# EAGLE design bb-psu-mk-1.1 (EAGLE 6.5.0)
VERSION: 1.0
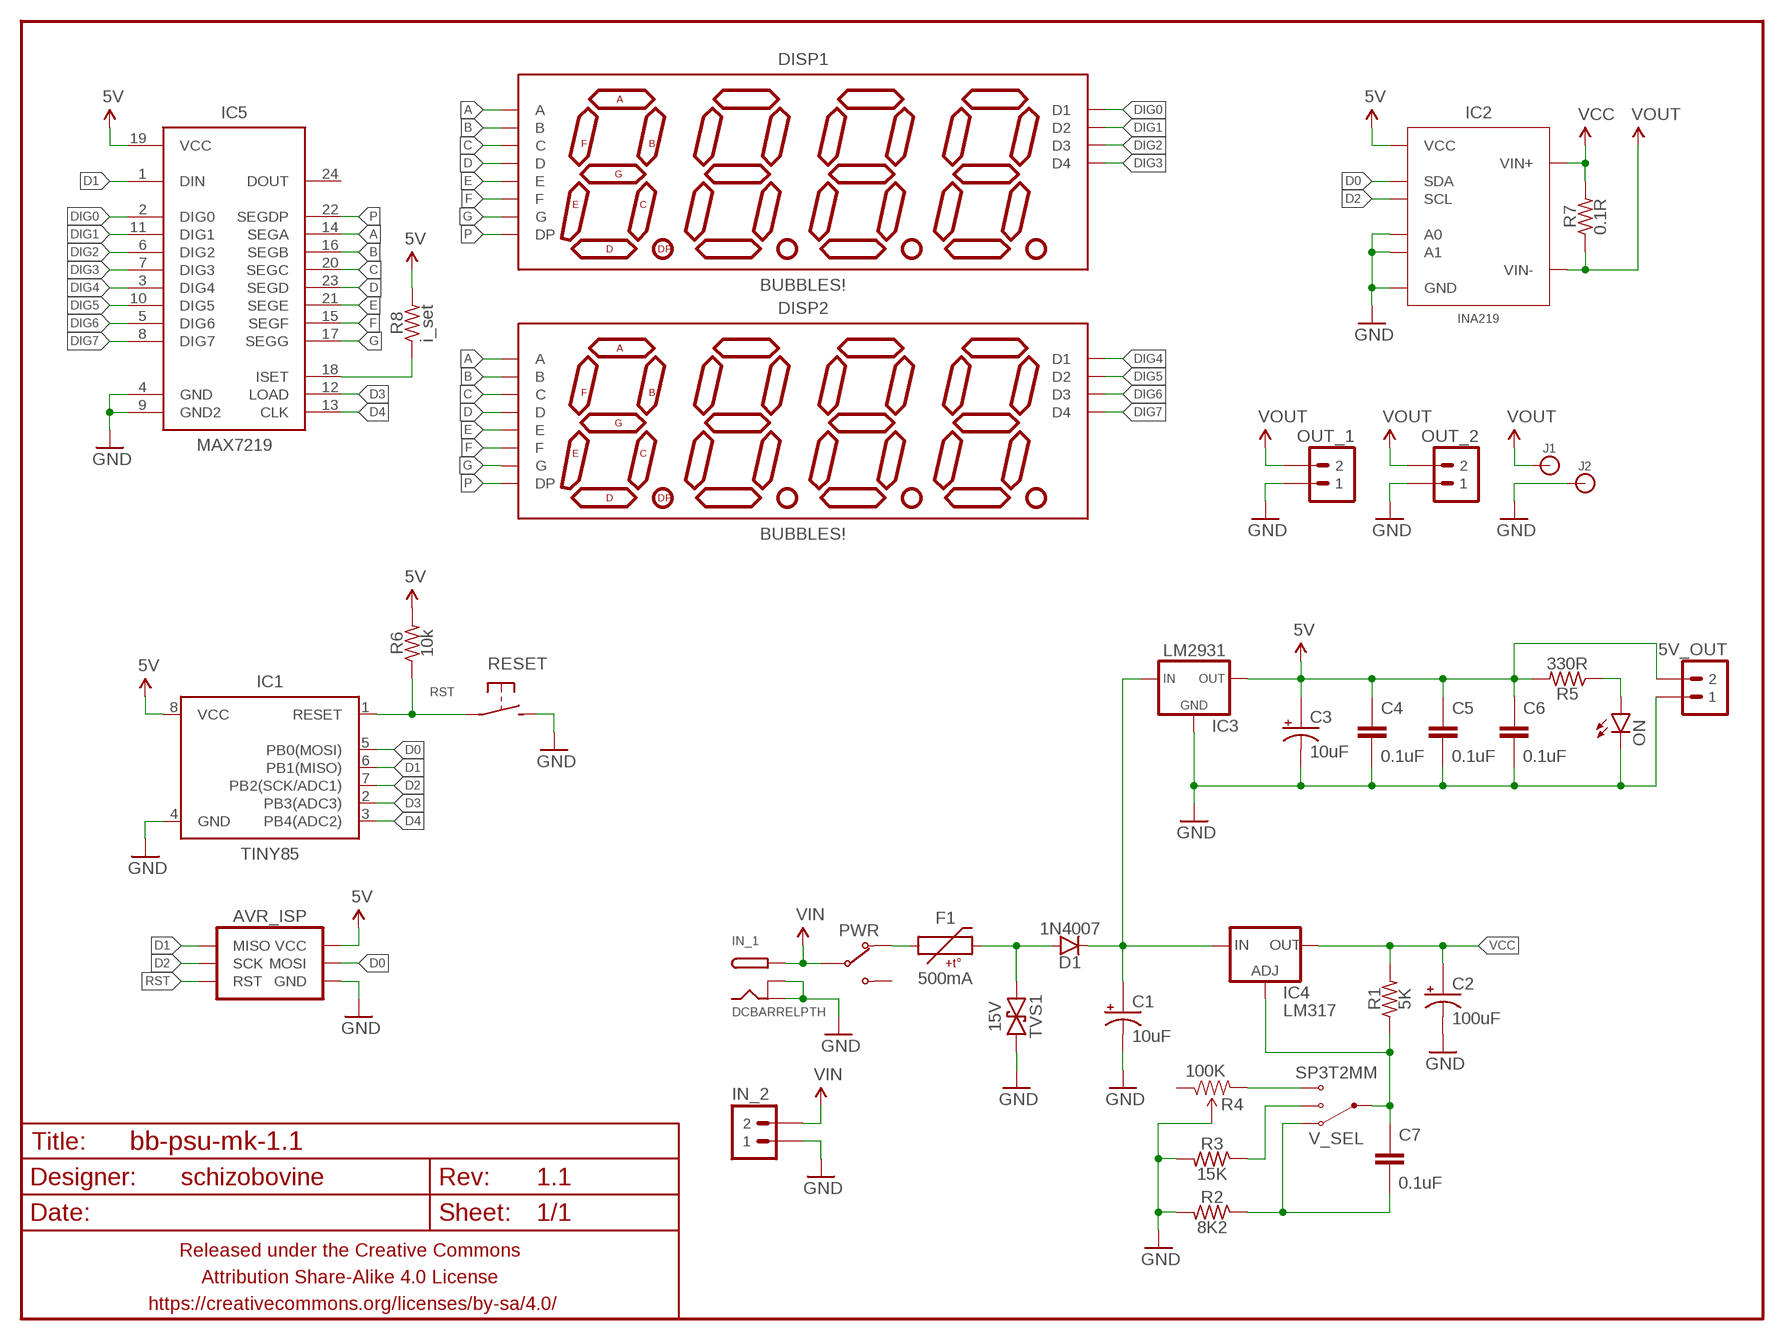
[diagram p0: schematic, sheet 1]

## Parts
5V_OUT  M02PTH-CENTERED-R+  [1X02-CENTER-R+]
AVR_ISP  AVR_SPI_PRG_6PTH  [2X3]
C1  10uF  CAPACITOR-POLARIZEDE2.5-6  [E2,5-6]
C2  100uF  CAPACITOR-POLARIZEDE2.5-6  [E2,5-6]
C3  10uF  CAPACITOR-POLARIZEDE2-5  [E2-5]
C4  0.1uF  CAPACITOR-CERAMIC025-024X044  [C025-024X044]
C5  0.1uF  CAPACITOR-CERAMIC025-024X044  [C025-024X044]
C6  0.1uF  CAPACITOR-CERAMIC025-024X044  [C025-024X044]
C7  0.1uF  CAPACITOR-CERAMIC025-024X044  [C025-024X044]
D1  1N4007  DIODEPTH-10.68MM  [DIODE-10.16MM]
DISP1  BUBBLES!  7SEG_4DIGITHP-BUBBLE  [DIL12]
DISP2  BUBBLES!  7SEG_4DIGITHP-BUBBLE  [DIL12]
F1  500mA  PTCPTH-5.08MM  [PTC-PTH-5.08MM]
FRAME1  FRAME-LETTERNO_PACKAGE  [DUMMY]
IC1  TINY85  ATTINY45TINY85-20-DIP  [DIP08]
IC2  INA219  INA219SOIC8  [SO08]
IC3  LM2931  V_REG_78XXTO-92-INLINE  [TO-92-AMMO]
IC4  LM317  V_REG_317THERMPAD  [TO220-THERMPAD]
IC5  MAX7219  MAX7219SOIC-W  [SO24W]
IN_1  DCBARRELPTH  [DCJACK_2MM_PTH]
IN_2  M02PTH-CENTERED-R+  [1X02-CENTER-R+]
J1  BANANA_CONNPOAST  [BINDING_POST]
J2  BANANA_CONNPOAST  [BINDING_POST]
ON  LED3MM-LESS  [LED3MM-LESSSILK]
OUT_1  M02PTH-CENTERED-R+  [1X02-CENTER-R+]
OUT_2  M02PTH-CENTERED-R+  [1X02-CENTER-R+]
PWR  SWITCH-SPDTPTH-VERT-2.54MM  [SWITCH-SPDT]
R1  5K  RESISTORPTH-AXIAL-6.35MM  [RESISTOR-AXIAL-PTH-6.35MM]
R2  8K2  RESISTORPTH-AXIAL-6.35MM  [RESISTOR-AXIAL-PTH-6.35MM]
R3  15K  RESISTORPTH-AXIAL-6.35MM  [RESISTOR-AXIAL-PTH-6.35MM]
R4  100K  TRIMPOT-PTH-KNOB  [3386U]
R5  330R  RESISTORPTH-AXIAL-5.08MM  [RESISTOR-AXIAL-PTH-5.08MM]
R6  10k  RESISTORPTH-AXIAL-5.08MM  [RESISTOR-AXIAL-PTH-5.08MM]
R7  0.1R  RESISTORPTH-AXIAL-10.16MM  [RESISTOR-AXIAL-PTH-10.16MM]
R8  i_set  RESISTORPTH-AXIAL-5.08MM  [RESISTOR-AXIAL-PTH-5.08MM]
RESET  SPST-NO-TACT3MM-PTH-SMALL-PADS  [DTS-3-SMALL-PADS]
TVS1  15V  TVSDO-41-10.16MM  [DO-41-TVS-BI-10.16MM]
V_SEL  SP3T2MM  [SP3T-2MM]

## Nets
5V: 5V_OUT.2 AVR_ISP.2(VCC) C3.+ C4.1 C5.1 C6.1 IC1.8(VCC) IC2.5(VCC) IC3.3(OUT) IC5.19(VCC) R5.P$2 R6.P$2 R8.P$2
A: DISP1.12(A) DISP2.12(A) IC5.14(SEGA)
B: DISP1.11(B) DISP2.11(B) IC5.16(SEGB)
C: DISP1.3(C) DISP2.3(C) IC5.20(SEGC)
D: DISP1.8(D) DISP2.8(D) IC5.23(SEGD)
D0: AVR_ISP.4(MOSI) IC1.5(PB0(MOSI)) IC2.3(SDA)
D1: AVR_ISP.1(MISO) IC1.6(PB1(MISO)) IC5.1(DIN)
D2: AVR_ISP.3(SCK) IC1.7(PB2(SCK/ADC1)) IC2.4(SCL)
D3: IC1.2(PB3(ADC3)) IC5.12(LOAD)
D4: IC1.3(PB4(ADC2)) IC5.13(CLK)
DIG0: DISP1.1(D1) IC5.2(DIG0)
DIG1: DISP1.10(D2) IC5.11(DIG1)
DIG2: DISP1.4(D3) IC5.6(DIG2)
DIG3: DISP1.6(D4) IC5.7(DIG3)
DIG4: DISP2.1(D1) IC5.3(DIG4)
DIG5: DISP2.10(D2) IC5.10(DIG5)
DIG6: DISP2.4(D3) IC5.5(DIG6)
DIG7: DISP2.6(D4) IC5.8(DIG7)
E: DISP1.2(E) DISP2.2(E) IC5.21(SEGE)
F: DISP1.9(F) DISP2.9(F) IC5.15(SEGF)
G: DISP1.7(G) DISP2.7(G) IC5.17(SEGG)
GND: 5V_OUT.1 AVR_ISP.6(GND) C1.- C2.- C3.- C4.2 C5.2 C6.2 IC1.4(GND) IC2.1(A1) IC2.2(A0) IC2.6(GND) IC3.2(GND) IC5.4(GND) IC5.9(GND2) IN_1.BRK IN_1.GND IN_2.1 J2.P$1 ON.K(C) OUT_1.1 OUT_2.1 R2.P$2 R3.P$2 R4.2(WIPER) RESET.2 TVS1.P$2
N$1: D1.A F1.P$2 TVS1.P$1
N$2: C1.+ D1.C IC3.1(IN) IC4.3(IN)
N$3: F1.P$1 PWR.1(NC)
N$4: ON.A R5.P$1
N$5: IC5.18(ISET) R8.P$1
N$6: C7.1 IC4.1(ADJ) R1.P$1 V_SEL.P$1(COM)
N$7: R3.P$1 V_SEL.P$3(B)
N$8: R4.3(CW) V_SEL.P$4(C)
N$10: C7.2 R2.P$1 V_SEL.P$2(A)
P: DISP1.5(DP) DISP2.5(DP) IC5.22(SEGDP)
RST: AVR_ISP.5(RST) IC1.1(RESET) R6.P$1 RESET.1
VCC: C2.+ IC2.8(VIN+) IC4.2@1(OUT) IC4.2@2(OUT) R1.P$2 R7.P$2
VIN: IN_1.PWR IN_2.2 PWR.2(COM)
VOUT: IC2.7(VIN-) J1.P$1 OUT_1.2 OUT_2.2 R7.P$1
Unconnected: IC5.24(DOUT) PWR.3(NO) R4.1(CCW)

## Library data of the parts
5V_OUT IN_2 OUT_1 OUT_2 = A_butts:M02: Standard 2-pin 0.1" header. Use with - straight break away headers ( PRT-00116) - right angle break away headers (PRT-00553) - swiss pins (PRT-00743) - machine pins (PRT-00117) - female headers (PRT-00115) Molex polarized connector foot print use with: PRT-08233 with associated crimp pins and housings. 2.54_SCREWTERM for use with PRT-10571. 3.5mm Screw Terminal footprints for PRT-08084 5mm Screw Terminal footprints for use with PRT-08433
AVR_ISP = A_butts:AVR_SPI_PRG_6: AVR ISP 6 Pin This is the reduced ISP connector for AVR programming. Common on Arduino. This footprint will take up less PCB space and can be used with a 10-pin to 6-pin adapter such as SKU: BOB-08508 **Special note about "TEST_POINT" package. The stop mask is on the top side, so if you want your programming test points to be on the bottom of your board, make sure to place this package on the bottom side of the board. This also ensure that the orientation to program from the bottom side will be correct.
C1-C3 = A_butts:CAPACITOR-POLARIZED: POLARIZED CAPACITOR, American symbol
C4-C7 = A_butts:CAPACITOR-CERAMIC: CAPACITOR, European symbol
D1 = A_butts:DIODE: Diode These are standard reverse protection diodes and small signal diodes. SMA package can handle up to about 1A. SOD-323 can handle about 200mA. What the SOD-323 package when ordering, there are some mfgs out there that are 5-pin packages.
DISP1 DISP2 = A_butts:7SEG_4DIGIT; STOREFRONT: COM-12710
F1 = A_butts:PTC: Resettable Fuse PTC Resettable Fuse. Spark Fun Electronics SKU : COM-08357
FRAME1 = A_butts:FRAME-LETTER: Schematic Frame Standard 8.5x11 US Letter frame; DESIGNER: schizobovine; VERSION: 1.1
IC1 = A_butts:ATTINY45: Atmel 8-pin 2/4/8kB flash uC; PROD_ID: IC-09445; VALUE: TINY85-20-DIP
IC2 = A_butts:INA219
IC3 = A_butts:V_REG_78XX: Voltage Regulator Standard 7805 5V regulator. IGO (Input Ground Output). Spark Fun Electronics SKU : COM-00107
IC4 = A_butts:V_REG_317: Voltage Regulator Standard LM317 adjustable voltage regulator. AOI (Adjust Output Input). Google 'LM317 Calculator' for easy to use app to get the two resistor values needed. 240/720 for 5V output. 240/390 for 3.3V output. Spark Fun Electronics SKU : COM-00527
IC5 = A_butts:MAX7219: 8-digit, 8-segment LED display driver, serial input
IN_1 = A_butts:DCBARREL: 2.0mm DC Barrel Jack DCJACK_2MM_PTH - Through Hole Jack (4UConnector: 05537)
J1 J2 = A_butts:BANANA_CONN: Through-hole banana jack
ON = A_butts:LED: LEDs Standard schematic elements and footprints for 5mm, 3mm, 1206, and 0603 sized LEDs. 5mm - Spark Fun Electronics SKU : COM-00529 (and others)
PWR = A_butts:SWITCH-SPDT
R1-R3 R5-R8 = A_butts:RESISTOR: RESISTOR, American symbol
R4 = A_butts:TRIMPOT: Various small potentiometers for "set-and-forget" applications
RESET = A_butts:SPST-NO-TACT
TVS1 = A_butts:TVS: Transient voltage suppressor- prevents ESD on inputs. Ignore package description- MBRA140 is NOT this type of part!!!
V_SEL = A_butts:SP3T

## Board
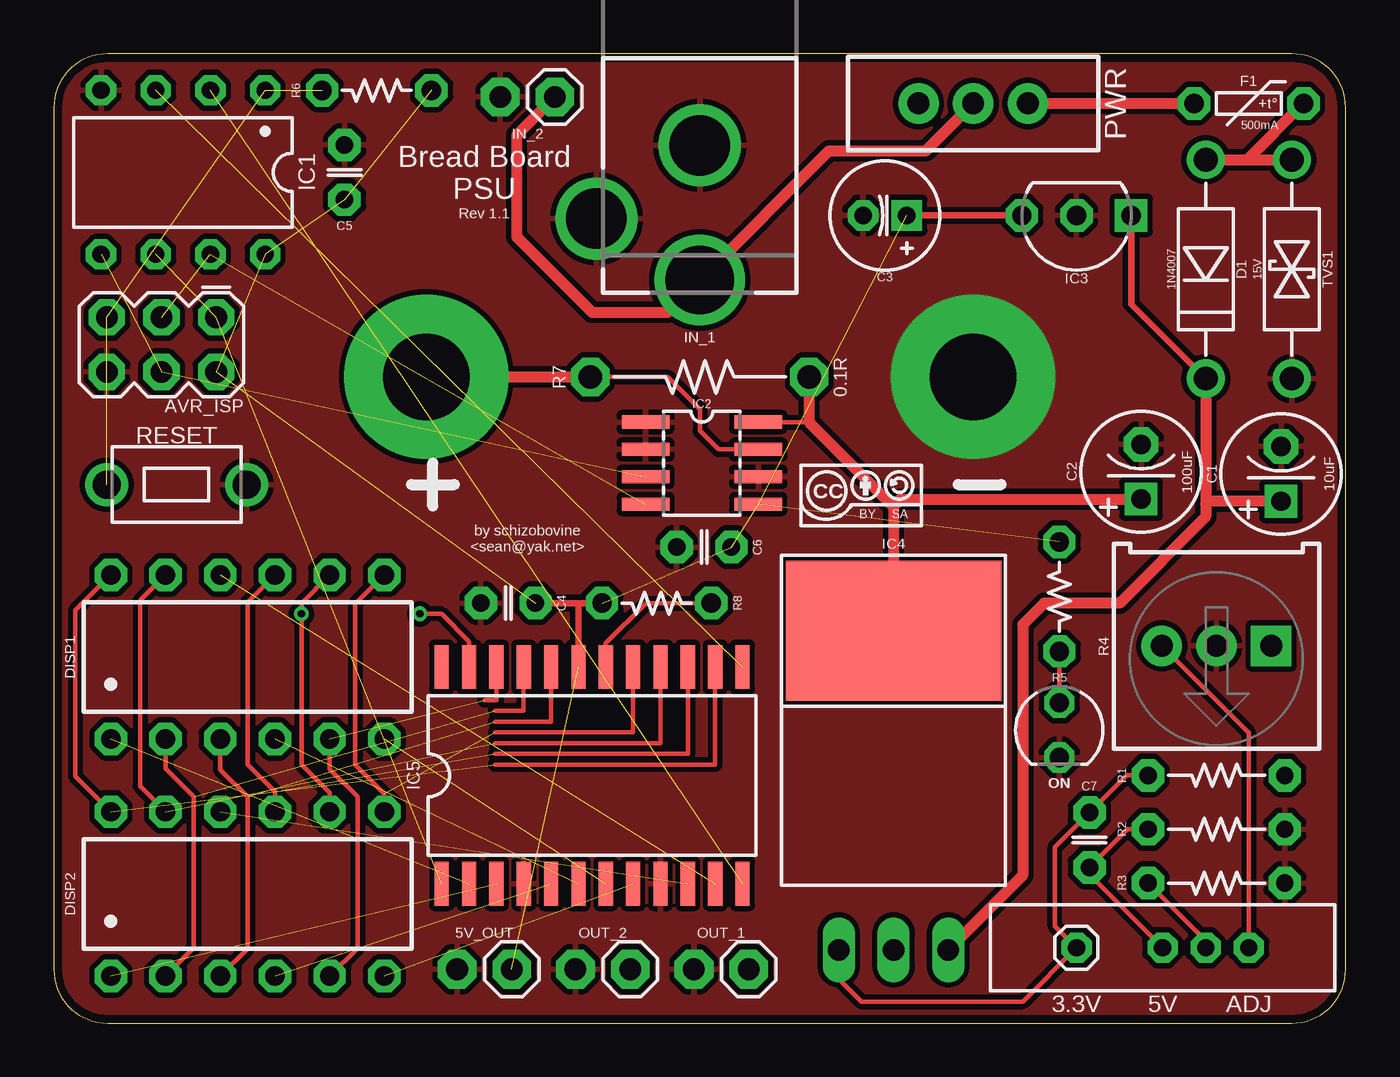
[diagram p1: board, top side]
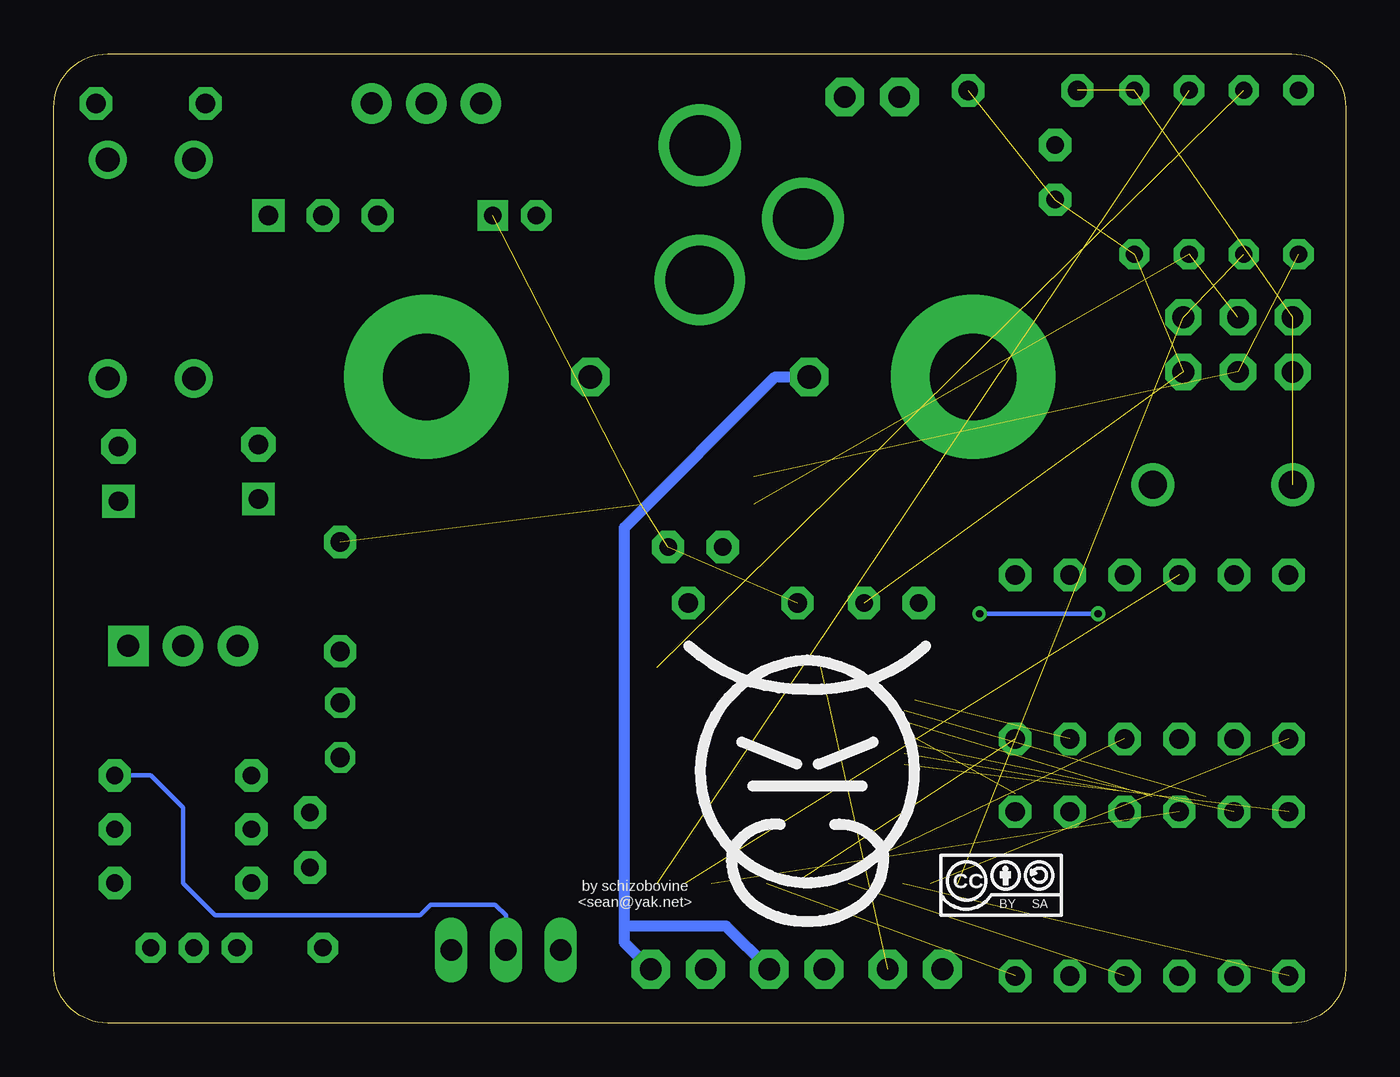
[diagram p2: board, bottom side, seen from below]

Size 60 x 45 mm. Coordinates in mm from the lower left corner, seen from the top.
Outline: 2.5,0 57.5,0 arc90 60,2.5 60,42.5 arc90 57.5,45 2.5,45 arc90 0,42.5 0,2.5 arc90 2.5,0
Copper layers (1*16): Top 0.0356mm / dielectric 1.5011mm / Bottom 0.0356mm
Design rules "LaenPCBOrder2": minimum track width 6mil, minimum drill 13mil, track to track 6mil, track to pad 6mil, pad to pad 6mil, via to via 6mil, smd to smd 6mil, copper to edge 15mil, drill to drill 6mil, minimum pad ring 7mil, minimum via ring 7mil, stop-mask expansion 3mil, vias tented up to drill 20mil, thermal gap 10mil

### Footprints (pad centres in the part's own frame; a part is rotated, then mirrored left to right if it is on the bottom)
1X02-CENTER-R+ = drill 1 pad 1.8 octagon: 1 -1.27,0; 2 1.27,0
2X3 = drill 1 pad 1.676 octagon: 1 -2.54,-1.27; 2 -2.54,1.27; 3 0,-1.27; 4 0,1.27; 5 2.54,-1.27; 6 2.54,1.27
E2,5-6 = drill 0.9 pad 1.524 square: + -1.27,0 | drill 0.9 pad 1.6 octagon: - 1.27,0
E2-5 = drill 0.813 pad 1.422 square: + -1.016,0 | drill 0.813 pad 1.422 octagon: - 1.016,0
C025-024X044 = drill 0.813 pad 1.5 octagon: 1 -1.27,0; 2 1.27,0
DIODE-10.16MM = drill 1.1 pad 1.778: A -5.08,0; C 5.08,0
DIL12 = drill 0.9 pad 1.5 octagon: 1 -6.35,-3.81; 2 -3.81,-3.81; 3 -1.27,-3.81; 4 1.27,-3.81; 5 3.81,-3.81; 6 6.35,-3.81; 7 6.35,3.81; 8 3.81,3.81; 9 1.27,3.81; 10 -1.27,3.81; 11 -3.81,3.81; 12 -6.35,3.81
PTC-PTH-5.08MM = drill 0.9 pad 1.5 octagon: P$1 -2.54,0; P$2 2.54,0
DIP08 = drill 0.8 pad 1.4 octagon: 1 -3.81,-3.81; 2 -1.27,-3.81; 3 1.27,-3.81; 4 3.81,-3.81; 5 3.81,3.81; 6 1.27,3.81; 7 -1.27,3.81; 8 -3.81,3.81
SO08 = smd 0.61 x 2.21: 1 -1.905,-2.616; 2 -0.635,-2.616; 3 0.635,-2.616; 4 1.905,-2.616; 5 1.905,2.616; 6 0.635,2.616; 7 -0.635,2.616; 8 -1.905,2.616
TO-92-AMMO = drill 0.9 pad 1.5 square: 1 -2.54,0 | drill 0.9 pad 1.5 octagon: 2 0,0; 3 2.54,0
TO220-THERMPAD = drill 1 long: 1 -2.54,0; 2@2 0,0; 3 2.54,0 | smd 10 x 6.5: 2@1 0,14.81
SO24W = smd 0.66 x 2.032: 1 -6.985,-5.029; 2 -5.715,-5.029; 3 -4.445,-5.029; 4 -3.175,-5.029; 5 -1.905,-5.029; 6 -0.635,-5.029; 7 0.635,-5.029; 8 1.905,-5.029; 9 3.175,-5.029; 10 4.445,-5.029; 11 5.715,-5.029; 12 6.985,-5.029; 13 6.985,5.029; 14 5.715,5.029; 15 4.445,5.029; 16 3.175,5.029; 17 1.905,5.029; 18 0.635,5.029; 19 -0.635,5.029; 20 -1.905,5.029; 21 -3.175,5.029; 22 -4.445,5.029; 23 -5.715,5.029; 24 -6.985,5.029
DCJACK_2MM_PTH = drill 2.8: BRK -4.8,2.85; GND 0,6.25 | drill 3.2: PWR 0,0
BINDING_POST = drill 4 pad 7.62: P$1 0,0
LED3MM-LESSSILK = drill 0.9 pad 1.4 octagon: A -1.27,0; K 1.27,0
SWITCH-SPDT = drill 1.016 pad 1.88: 1 0,2.54; 2 0,0; 3 0,-2.54
RESISTOR-AXIAL-PTH-6.35MM = drill 0.8 pad 1.5 octagon: P$1 -3.175,0; P$2 3.175,0
3386U = drill 1.016 pad 1.88 square: 1 -2.54,-0.015 | drill 1.016 pad 1.88: 2 0,-0.015; 3 2.54,-0.015
RESISTOR-AXIAL-PTH-5.08MM = drill 0.9 pad 1.5 octagon: P$1 -2.54,0; P$2 2.54,0
RESISTOR-AXIAL-PTH-10.16MM = drill 1.1 pad 1.778 octagon: P$1 -5.08,0; P$2 5.08,0
DTS-3-SMALL-PADS = drill 1.3 pad 2: 1 -3.25,0; 2 3.25,0
DO-41-TVS-BI-10.16MM = drill 1.1 pad 1.778: P$1 -5.08,0; P$2 5.08,0
SP3T-2MM = drill 0.8 pad 1.4 octagon: P$1 -4,0; P$2 0,0; P$3 2,0; P$4 4,0

### Placement (x,y rotation side)
5V_OUT  20,2.5 0 top
AVR_ISP  5,31.5 180 top
C1  57,25.5 90 top
C2  50.5,25.6 90 top
C3  38.6,37.5 180 top
C4  21.1,19.5 180 top
C5  13.5,39.5 90 top
C6  30.2,22.1 180 top
C7  48.1,8.5 270 top
D1  53.5,35 270 top
DISP1  9,17 0 top
DISP2  9,6 0 top
F1  55.5,42.7 0 top
FRAME1  0,0 0 top
IC1  6,39.5 180 top
IC2  30.1,26 270 top
IC3  47.5,37.5 180 top
IC4  39,3.4 0 top
IC5  25,11.5 0 top
IN_1  30,34.5 0 top
IN_2  22,43 0 top
J1  17.3,30 0 top
J2  42.7,30 0 top
ON  46.7,13.6 270 top
OUT_1  31,2.5 0 top
OUT_2  25.5,2.5 0 top
PWR  42.7,42.7 270 top
R1  54,11.5 0 top
R2  54,9 0 top
R3  54,6.5 0 top
R4  54,17.5 180 top
R5  46.7,19.8 90 top
R6  15,43.3 0 top
R7  30,30 0 top
R8  28,19.5 180 top
RESET  5.7,25 0 top
TVS1  57.5,35 270 top
U$1  [CC-BY-SA-4.0-NO-URL]  16,6.4 0 bottom
U$2  [CC-BY-SA-4.0-NO-URL]  37.5,24.5 0 top
U$3  [COW]  25,10.5 0 bottom
V_SEL  51.5,3.5 0 top

### Tracks (layer width: path | path; a pad name or v marks a point on that pad's centre or on a via)
5V  (9 unrouted)
  Top 0.3: C3.+ IC3.3 | IC5.19 24.36,19.5 | 24.36,19.5 C4.1 | R8.P$2 24.36,19.5
A  (1 unrouted)
  Top 0.2: DISP1.12 1,19.16 1,11.46 DISP2.12 | IC5.14 30.71,12 20.5,12
B  (1 unrouted)
  Top 0.2: DISP1.11 4,19.62 4,11 DISP2.11 | IC5.16 28.18,13 20.5,13
C  (1 unrouted)
  Top 0.2: DISP1.3 7.73,11.77 9,10.5 9,3.46 DISP2.3 | IC5.20 23.09,14 20.5,14
D  (via drill 0.33)
  Top 0.2: DISP1.8 11.5,19.5 v11.5,19 11.5,12 12.81,10.69 DISP2.8 | IC5.23 19.29,17.71 18,19 v17,19
  Bottom 0.2: v17,19 v11.5,19
D0  (2 unrouted)
D1  (2 unrouted)
D2  (2 unrouted)
D3  (1 unrouted)
D4  (1 unrouted)
DIG0  (1 unrouted)
DIG1  (1 unrouted)
DIG2  (1 unrouted)
DIG3  (1 unrouted)
DIG4  (1 unrouted)
DIG5  (1 unrouted)
DIG6  (1 unrouted)
DIG7  (1 unrouted)
E  (1 unrouted)
  Top 0.2: DISP1.2 5.19,11.81 6.5,10.5 6.5,3.5 DISP2.2 | IC5.21 21.82,14.5 20.5,14.5
F  (1 unrouted)
  Top 0.2: DISP1.9 9,19.54 9,12 10.27,10.73 DISP2.9 | IC5.15 29.45,12.5 20.5,12.5
G  (1 unrouted)
  Top 0.2: DISP1.7 14,19.46 14,12 15.35,10.65 DISP2.7 | IC5.17 26.91,13.5 20.5,13.5
GND
  pour Top (isolate 0.25): 2.5,45 57.5,45 arc-90 60,42.5 60,2.5 arc-90 57.5,0 2.5,0 arc-90 0,2.5 0,42.5 arc-90
N$1
  Top 0.5: D1.A 55.42,40.08 | 55.42,40.08 F1.P$2 | 55.42,40.08 TVS1.P$1
N$2
  Top 0.3: D1.C 50.04,33.38 IC3.1
  Top 0.5: D1.C 53.5,24.1 | 53.5,24.1 53.5,23.5 49.5,19.5 46,19.5 45,18.5 45,6.86 IC4.3 | C1.+ 53.63,24.23 53.5,24.1
N$3
  Top 0.5: PWR.1 F1.P$1
N$4
  Top 0.2: R5.P$1 ON.A
N$5
  Top 0.2: IC5.18 25.64,17.64 27.5,19.5 R8.P$1
N$6
  Top 0.2: IC4.1 36.46,2.04 37.5,1 45,1 V_SEL.P$1 46.5,4.5 46.5,8.17 C7.1 49.83,11.5 R1.P$1
N$7
  Top 0.2: R3.P$1 53.5,3.83 V_SEL.P$3
N$8
  Top 0.2: R4.3 55.5,13.47 V_SEL.P$4
N$10
  Top 0.2: V_SEL.P$2 48.1,6.9 C7.2 49.87,9 R2.P$1
P  (1 unrouted)
  Top 0.2: DISP1.5 12.81,11.79 14.1,10.5 14.1,3.48 DISP2.5 | IC5.22 20.55,15 20,15
RST  (3 unrouted)
VCC
  Top 0.2: IC2.8 35.08,27.9
  Top 0.5: IC4.2@1 39,24 39.1,24.1 | R7.P$2 35.08,27.9 38.88,24.1 39.1,24.1 | IC2.8 | 39.1,24.1 39.33,24.33 C2.+
  Bottom 0.2: IC4.2@2 39,5 39.5,5.5 42.5,5.5 43,5 52.5,5 54,6.5 54,10 55.5,11.5 R1.P$2
VIN
  Top 0.5: IN_2.2 21.5,41.23 21.5,36.5 25,33 28.5,33 IN_1.PWR 36,40.5 40.5,40.5 PWR.2
VOUT
  Top 0.2: R7.P$1 28.5,30 30,28.5 30,27.5 30.86,26.64 IC2.7
  Top 0.5: J1.P$1 R7.P$1
  Bottom 0.5: OUT_1.2 33.5,3.73 33.5,4.5 | 33.5,4.5 33.5,23 26.5,30 R7.P$1 | OUT_2.2 28.77,4.5 33.5,4.5

### Text on the board
tPlace: Bread Board / PSU | by schizobovine / <sean@yak.net> | 3.3V | 5V | ADJ
bPlace: by schizobovine / <sean@yak.net>